# Altium schematic sheet Control_Board.SchDoc
size A
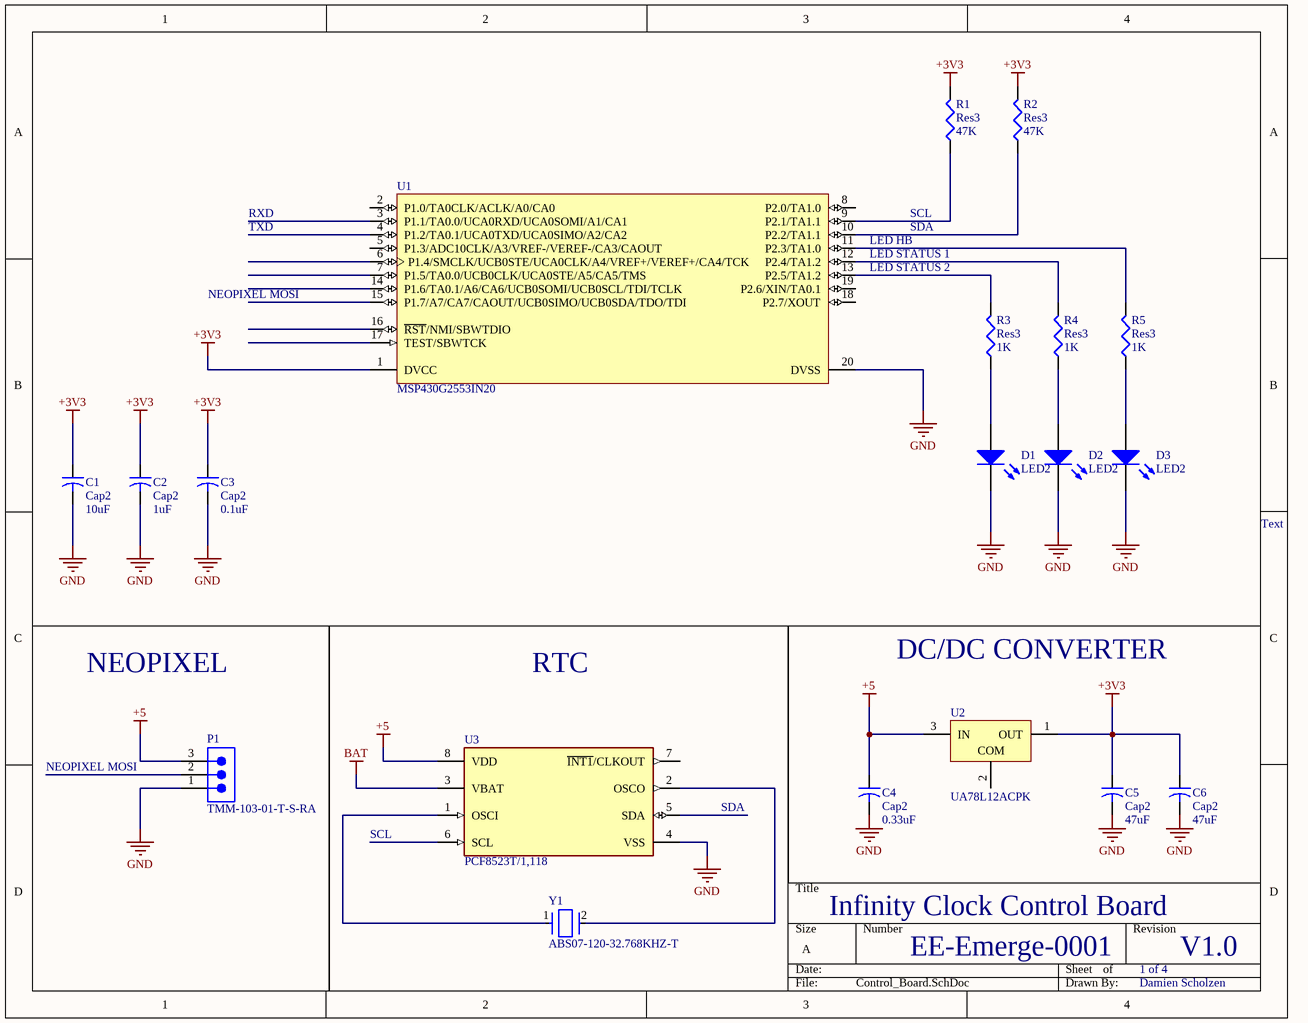
[diagram p0: Control_Board.SchDoc]

## Parts
C1  Cap2  value 10uF  [C0805]
C2  Cap2  value 1uF  [C0805]
C3  Cap2  value 0.1uF  [C0805]
C4  Cap2  value 0.33uF  [C0805]
C5  Cap2  value 47uF  [C0805]
C6  Cap2  value 47uF  [C0805]
D1  LED2  [3.2X1.6X1.1]
D2  LED2  [3.2X1.6X1.1]
D3  LED2  [3.2X1.6X1.1]
P1  TMM-103-01-T-S-RA  [SMTC-TMM-103-01-X-S-RA]
R1  Res3  value 47K  [6-0805_N]
R2  Res3  value 47K  [6-0805_N]
R3  Res3  value 1K  [6-0805_N]
R4  Res3  value 1K  [6-0805_N]
R5  Res3  value 1K  [6-0805_N]
U1  MSP430G2553IN20  [N0020A]
U2  UA78L12ACPK  [PK0003A_M]
U3  PCF8523T/1,118  [FP-SOT96-1-IPC_B]
Y1  ABS07-120-32.768KHZ-T  [FP-ABS07-120-MFG]

## Nets
+3V3: C1.1 C2.1 C3.1 C5.1 C6.1 R1.2 R2.2 U1.1(DVCC) U2.1(OUT)
+5: C4.1 P1.3 U2.3(IN) U3.8(VDD)
BAT: U3.3(VBAT)
GND: C1.2 C2.2 C3.2 C4.2 C5.2 C6.2 D1.2(K) D2.2(K) D3.2(K) P1.1 U1.20(DVSS) U3.4(VSS)
NetD1_1: D1.1(A) R3.1
NetD2_1: D2.1(A) R4.1
NetD3_1: D3.1(A) R5.1
NetR1_1: R1.1 U1.9(P2.1/TA1.1)
NetR2_1: R2.1 U1.10(P2.2/TA1.1)
NetR3_2: R3.2 U1.13(P2.5/TA1.2)
NetR4_2: R4.2 U1.12(P2.4/TA1.2)
NetR5_2: R5.2 U1.11(P2.3/TA1.0)
NetU3_1: U3.1(OSCI) Y1.1
NetU3_2: U3.2(OSCO) Y1.2

Not connected (* = marked no-connect by the designer): P1 2; U1 2(P1.0/TA0CLK/ACLK/A0/CA0) 3(P1.1/TA0.0/UCA0RXD/UCA0SOMI/A1/CA1) 4(P1.2/TA0.1/UCA0TXD/UCA0SIMO/A2/CA2) 5(P1.3/ADC10CLK/A3/VREF-/VEREF-/CA3/CAOUT) 6(P1.4/SMCLK/UCB0STE/UCA0CLK/A4/VREF+/VEREF+/CA4/TCK) 7(P1.5/TA0.0/UCB0CLK/UCA0STE/A5/CA5/TMS) 8(P2.0/TA1.0) 14(P1.6/TA0.1/A6/CA6/UCB0SOMI/UCB0SCL/TDI/TCLK) 15(P1.7/A7/CA7/CAOUT/UCB0SIMO/UCB0SDA/TDO/TDI) 16(~{RST}/NMI/SBWTDIO) 17(TEST/SBWTCK) 18(P2.7/XOUT) 19(P2.6/XIN/TA0.1); U2 2(COM); U3 5(SDA) 6(SCL) 7(~{INT1}/CLKOUT)

## Notes on the sheet
- RXD
- TXD
- SCL
- SDA
- NEOPIXEL MOSI
- (near U1) LED HB
- (near U1) LED STATUS 1
- LED STATUS 2
- Text
- NEOPIXEL
- RTC
- DC/DC CONVERTER
- Infinity Clock Control Board
- EE-Emerge-0001
- 1 of 4
- V1.0
- Damien Scholzen

## Library data of the parts
C1 = Cap2: Capacitor; Published: 23-Sep-2002; PackageReference: CAPR5-4X5; Publisher: Altium Limited; PackageDescription: Capacitor; 2 Leads
C2 = Cap2_1: Capacitor; Published: 23-Sep-2002; PackageReference: CAPR5-4X5; Publisher: Altium Limited; PackageDescription: Capacitor; 2 Leads
C3 = Cap2_2: Capacitor; Published: 23-Sep-2002; PackageReference: CAPR5-4X5; Publisher: Altium Limited; PackageDescription: Capacitor; 2 Leads
C4 = Cap2_4: Capacitor; Published: 23-Sep-2002; PackageReference: CAPR5-4X5; Publisher: Altium Limited; PackageDescription: Capacitor; 2 Leads
C5 C6 = Cap2_5: Capacitor; Published: 23-Sep-2002; PackageReference: CAPR5-4X5; Publisher: Altium Limited; PackageDescription: Capacitor; 2 Leads
D1-D3 = LED2: Typical RED, GREEN, YELLOW, AMBER GaAs LED; Published: 8-Jun-2000; LatestRevisionDate: 17-Jul-2002; LatestRevisionNote: Re-released for DXP Platform.; PackageVersion: Feb-2002; PackageReference: 3.2X1.6X1.1; Publisher: Altium Limited; PackageDescription: SM LED; 2 Flat Leads
P1 = CMP-1029-00176-1: Low Profile Through-Hole Header, Right Angle, -55 to 105 degC, 2 mm Pitch, 3-Pin, Male, RoHS; Manufacturer: Samtec; Pitch: 2 mm; PackageDescription: 2 mm Terminal Strip Assembly (R/A); Mounting Technology: Through-hole; ComponentLink3URL: http://www.samtec.com/documents/webfiles/cpdf/TMM-1XX-XX-XX-X-RA-XXX-MKT.pdf; RoHS: True; Temperature Range: -55 to 105 degC; PackageVersion: V, 3/2013; ComponentLink3Description: Package Specification; ComponentLink1Description: Manufacturer URL; ComponentLink2Description: Datasheet; PackageReference: TMM-103-01-X-S-RA; ComponentLink1URL: http://www.samtec.com; PartNumber: TMM-103-01-T-S-RA; DatasheetVersion: F-214; Orientation: Right Angle; ComponentLink2URL: http://d2a072wq521u33.cloudfront.net/catalog_english//TMM_TH.PDF; Manufacturer 1: Samtec; Manufacturer Part Number 1: TMM-103-01-T-S-RA
R1 R2 = Res3_1: Resistor; Published: 8-Jun-2000; LatestRevisionDate: 29-May-2009; LatestRevisionNote: IPC-7351 Footprint Added.; PackageReference: J1-0603; Publisher: Altium Limited; PackageDescription: Chip Resistor
R3-R5 = Res3_2: Resistor; Published: 8-Jun-2000; LatestRevisionDate: 29-May-2009; LatestRevisionNote: IPC-7351 Footprint Added.; PackageReference: J1-0603; Publisher: Altium Limited; PackageDescription: Chip Resistor
U1 = CMP-0365-00184-2: 16 MHz Mixed Signal Microcontroller with 16 KB Flash, 512 B SRAM and 24 GPIOs, -40 to 85 degC, 20-pin DIP (N), Pb-Free (RoHS); Manufacturer: Texas Instruments; USCI_B (I2C & SPI): 1; Temp Sensor: Yes; SubFamily: Value Line; Frequency(MHz): 16; ADC Channels: 8; SRAM(B): 512; ADC: 10-bit SAR; GPIO: 24; Timers - 16-bit: 2; Code_JEDEC: MS-001; Eco-Plan: Pb-Free (RoHS); PartNumber: MSP430G2553IN20; ComponentLink1URL: http://www.ti.com/; PackageVersion: 4040049/E; Comparators: Yes; Watchdog: Yes; ComponentLink2Description: Datasheet; ComponentLink1Description: Manufacturer URL; Mounting Technology: Through Hole; ComponentLink2URL: http://www.ti.com/general/docs/lit/getliterature.tsp?genericPartNumber=MSP430G2553&fileType=pdf; Brown Out Reset: Yes; PackageReference: N0020A; PackageDescription: 20-Pin Plastic In-Line, Body 25.40 x 6.35 mm, Pitch 2.54 mm; ComponentLink3URL: http://www.ti.com/litv/pdf/mpds177g; ComponentLink3Description: Package Specification; Flash(KB): 16; Cap touch I/O: Yes; USCI_A (UART/LIN/IrDA/SPI): 1; DatasheetVersion: SLAS735G; Manufacturer 1: Texas Instruments; Manufacturer Part Number 1: MSP430G2553IN20
U2 = CMP-0324-00094-3: Regulator with 14.5 to 27 V Input and 12 V Output, 0 to 125 degC, 3-Pin SOT-89 (PK), Green (RoHS & no Sb/Br); Manufacturer 1: Texas Instruments; SubFamily: Standard Voltage Regulator; Vin(Max)(V): 27; Vin(Min)(V): 14.5; Vout(Max)(V): 12; Iq(Typ)(mA): 6; Iout(Max)(A): 0.1; PackageDescription: 3-Pin Plastic Small Outline, Body 2.5 x 4.5 mm, Pitch 1.5 mm; PackageVersion: 4040234/D, 02/2006; Eco-Plan: Green (RoHS & no Sb/Br); Mounting Technology: Through Hole; Code_JEDEC: TO-243; PartNumber: UA78L12ACPK; DatasheetVersion: SLVS010S; PackageReference: PK0003A; Vout(Min)(V): 12; Manufacturer Part Number 1: UA78L12ACPK
U3 = CMP-10083-000014-1: IC RTC CLK/CALENDAR I2C 8-SOIC; Time Format: HH:MM:SS; Min Supply Voltage: 1.2V; Max Supply Voltage: 5.5V; Logic Function: Clock; Min Operating Temperature: -40°C; Case/Package: SO; Radiation Hardening: No; Interface: I2C; Max Operating Temperature: 85°C; Contact Plating: Gold; Packaging: Tape and Reel; Package Quantity: 2500; Lead Free: Lead Free; Number of Pins: 8; Mount: Surface Mount; REACH SVHC: No SVHC
Y1 = CMP-2000-07587-2: CRYSTAL 32.7680KHZ 6PF SMD; Frequency Tolerance: 20ppm; Series Resistance: 60kR; ESR (Equivalent Series Resistance): 55kR; Depth: 1.5mm; Width: 0.061inch; Number of Pins: 2; Max Operating Temperature: 85°C; Length: 3.2mm; Case/Package: SMD/SMT; Series: ABS07; Lead Free: Lead Free; Min Operating Temperature: -40°C; Load Capacitance: 6pF; Packaging: Tape and Reel; Height: 0.035inch; Radiation Hardening: No; Tolerance: 20ppm; Operating Frequency: 32.768 kHz; Termination: SMD/SMT; REACH SVHC: No SVHC; RoHS Compliant: Yes; Frequency: 32.768kHz; Package Quantity: 3000; Mount: Surface Mount